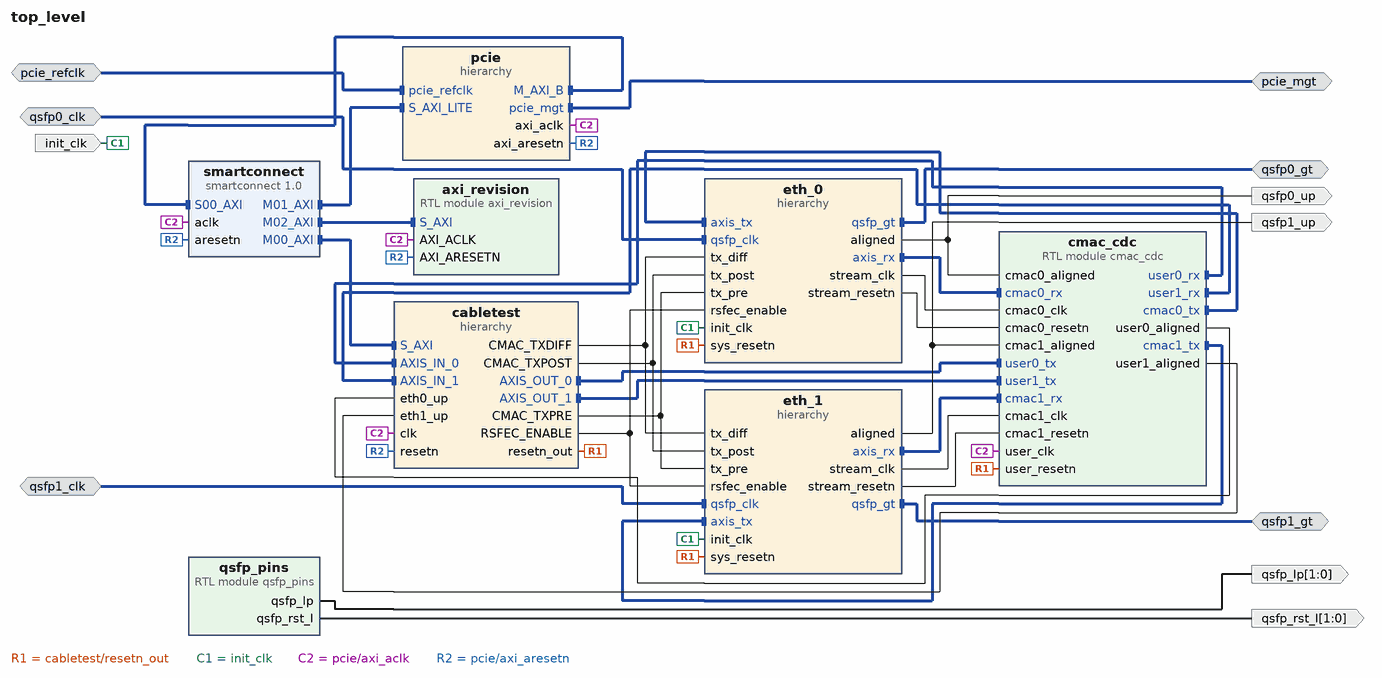
[diagram p0: block diagram of the top level]
# Vivado block design top_level, xcku15p-ffve1517-3-e, Vivado 2021.1
create_bd_design top_level

create_bd_intf_port -mode Slave -vlnv xilinx.com:interface:diff_clock_rtl:1.0 pcie_refclk
create_bd_intf_port -mode Master -vlnv xilinx.com:interface:pcie_7x_mgt_rtl:1.0 pcie_mgt
create_bd_intf_port -mode Slave -vlnv xilinx.com:interface:diff_clock_rtl:1.0 qsfp0_clk
set_property -dict {CONFIG.FREQ_HZ 322265625} [get_bd_intf_ports qsfp0_clk]
create_bd_intf_port -mode Master -vlnv xilinx.com:interface:gt_rtl:1.0 qsfp0_gt
create_bd_intf_port -mode Master -vlnv xilinx.com:interface:gt_rtl:1.0 qsfp1_gt
create_bd_intf_port -mode Slave -vlnv xilinx.com:interface:diff_clock_rtl:1.0 qsfp1_clk
set_property -dict {CONFIG.FREQ_HZ 322265625} [get_bd_intf_ports qsfp1_clk]
create_bd_port -dir O qsfp1_up
create_bd_port -dir O qsfp0_up
create_bd_port -dir I init_clk
create_bd_port -dir O -from 1 -to 0 qsfp_lp
create_bd_port -dir O -from 1 -to 0 qsfp_rst_l

create_bd_cell -type hier pcie
create_bd_cell -type hier eth_0
create_bd_cell -type ip -vlnv xilinx.com:ip:smartconnect:1.0 smartconnect
set_property -dict {CONFIG.NUM_CLKS 1 CONFIG.NUM_MI 3 CONFIG.NUM_SI 2} [get_bd_cells smartconnect]
create_bd_cell -type hier eth_1
create_bd_cell -type hier cabletest
create_bd_cell -type module -reference cmac_cdc cmac_cdc
create_bd_cell -type module -reference qsfp_pins qsfp_pins
create_bd_cell -type module -reference axi_revision axi_revision

# ---- hierarchy /pcie ----
current_bd_instance /pcie
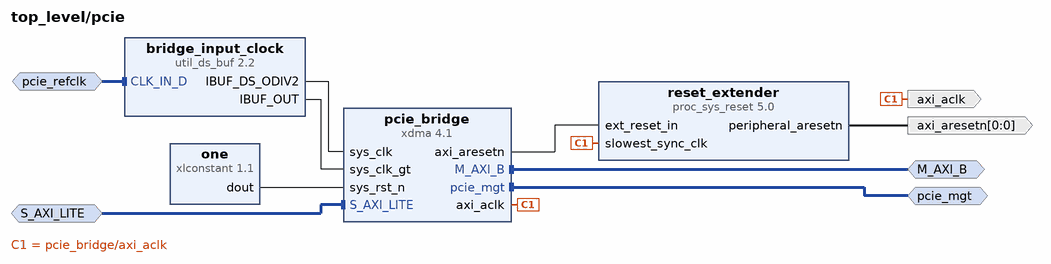
[diagram p1: block diagram inside /pcie]
create_bd_intf_pin -mode Master -vlnv xilinx.com:interface:aximm_rtl:1.0 M_AXI_B
create_bd_intf_pin -mode Slave -vlnv xilinx.com:interface:aximm_rtl:1.0 S_AXI_LITE
create_bd_intf_pin -mode Master -vlnv xilinx.com:interface:pcie_7x_mgt_rtl:1.0 pcie_mgt
create_bd_intf_pin -mode Slave -vlnv xilinx.com:interface:diff_clock_rtl:1.0 pcie_refclk
create_bd_pin -dir O -type clk axi_aclk
create_bd_pin -dir O -from 0 -to 0 -type rst axi_aresetn

create_bd_cell -type ip -vlnv xilinx.com:ip:util_ds_buf:2.2 bridge_input_clock
set_property -dict {CONFIG.C_BUF_TYPE IBUFDSGTE} [get_bd_cells bridge_input_clock]
create_bd_cell -type ip -vlnv xilinx.com:ip:xdma:4.1 pcie_bridge
set_property -dict [list \
  CONFIG.PF0_DEVICE_ID_mqdma 903F \
  CONFIG.PF0_SRIOV_VF_DEVICE_ID A03F \
  CONFIG.PF2_DEVICE_ID_mqdma 923F \
  CONFIG.PF3_DEVICE_ID_mqdma 933F \
  CONFIG.axi_addr_width 64 \
  CONFIG.axi_data_width 512_bit \
  CONFIG.axisten_freq 250 \
  CONFIG.bridge_burst true \
  CONFIG.dma_reset_source_sel User_Reset \
  CONFIG.en_axi_slave_if false \
  CONFIG.enable_jtag_dbg false \
  CONFIG.functional_mode AXI_Bridge \
  CONFIG.mode_selection Advanced \
  CONFIG.pcie_blk_locn X0Y3 \
  CONFIG.pf0_bar0_scale Megabytes \
  CONFIG.pf0_bar0_size 1 \
  CONFIG.pf0_bar1_enabled true \
  CONFIG.pf0_bar1_scale Megabytes \
  CONFIG.pf0_bar1_size 1 \
  CONFIG.pf0_device_id 903F \
  CONFIG.pl_link_cap_max_link_speed 8.0_GT/s \
  CONFIG.pl_link_cap_max_link_width X16 \
  CONFIG.plltype QPLL1 \
] [get_bd_cells pcie_bridge]
create_bd_cell -type ip -vlnv xilinx.com:ip:xlconstant:1.1 one
create_bd_cell -type ip -vlnv xilinx.com:ip:proc_sys_reset:5.0 reset_extender

# ---- hierarchy /eth_0 ----
current_bd_instance /eth_0
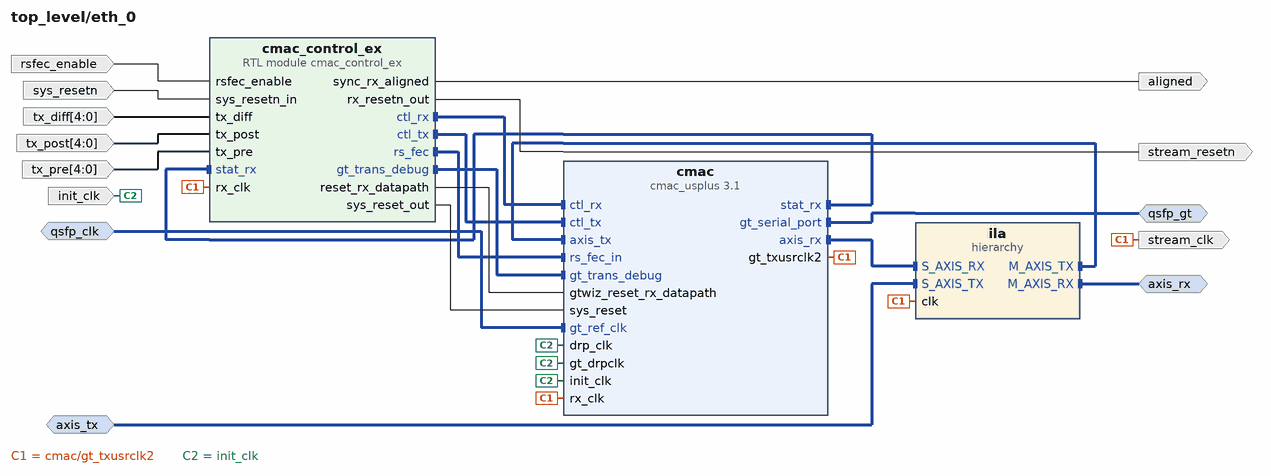
[diagram p2: block diagram inside /eth_0]
create_bd_intf_pin -mode Master -vlnv xilinx.com:interface:gt_rtl:1.0 qsfp_gt
create_bd_intf_pin -mode Slave -vlnv xilinx.com:interface:diff_clock_rtl:1.0 qsfp_clk
create_bd_intf_pin -mode Slave -vlnv xilinx.com:interface:axis_rtl:1.0 axis_tx
create_bd_intf_pin -mode Master -vlnv xilinx.com:interface:axis_rtl:1.0 axis_rx
create_bd_pin -dir I -type rst sys_resetn
create_bd_pin -dir O -type clk stream_clk
create_bd_pin -dir O -type rst stream_resetn
create_bd_pin -dir O aligned
create_bd_pin -dir I init_clk
create_bd_pin -dir I rsfec_enable
create_bd_pin -dir I -from 4 -to 0 tx_pre
create_bd_pin -dir I -from 4 -to 0 tx_post
create_bd_pin -dir I -from 4 -to 0 tx_diff

create_bd_cell -type ip -vlnv xilinx.com:ip:cmac_usplus:3.1 cmac
set_property -dict [list \
  CONFIG.ADD_GT_CNRL_STS_PORTS 1 \
  CONFIG.CMAC_CAUI4_MODE 1 \
  CONFIG.CMAC_CORE_SELECT CMACE4_X0Y0 \
  CONFIG.GT_DRP_CLK 200 \
  CONFIG.GT_GROUP_SELECT {X0Y0~X0Y3} \
  CONFIG.GT_REF_CLK_FREQ 322.265625 \
  CONFIG.INCLUDE_RS_FEC 1 \
  CONFIG.NUM_LANES 4x25 \
  CONFIG.RX_FLOW_CONTROL 0 \
  CONFIG.TX_FLOW_CONTROL 0 \
  CONFIG.USER_INTERFACE AXIS \
] [get_bd_cells cmac]
create_bd_cell -type module -reference cmac_control_ex cmac_control_ex
create_bd_cell -type hier ila

# ---- hierarchy /eth_0/ila ----
current_bd_instance /eth_0/ila
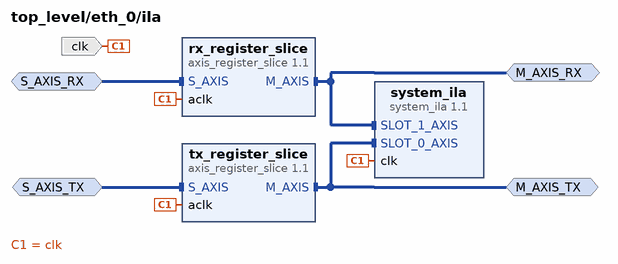
[diagram p3: block diagram inside /eth_0/ila]
create_bd_intf_pin -mode Slave -vlnv xilinx.com:interface:axis_rtl:1.0 S_AXIS_TX
create_bd_intf_pin -mode Master -vlnv xilinx.com:interface:axis_rtl:1.0 M_AXIS_TX
create_bd_intf_pin -mode Master -vlnv xilinx.com:interface:axis_rtl:1.0 M_AXIS_RX
create_bd_intf_pin -mode Slave -vlnv xilinx.com:interface:axis_rtl:1.0 S_AXIS_RX
create_bd_pin -dir I clk

create_bd_cell -type ip -vlnv xilinx.com:ip:axis_register_slice:1.1 tx_register_slice
create_bd_cell -type ip -vlnv xilinx.com:ip:axis_register_slice:1.1 rx_register_slice
create_bd_cell -type ip -vlnv xilinx.com:ip:system_ila:1.1 system_ila
set_property -dict [list \
  CONFIG.C_DATA_DEPTH 2048 \
  CONFIG.C_NUM_MONITOR_SLOTS 2 \
  CONFIG.C_SLOT 1 \
  CONFIG.C_SLOT_0_INTF_TYPE xilinx.com:interface:axis_rtl:1.0 \
  CONFIG.C_SLOT_1_INTF_TYPE xilinx.com:interface:axis_rtl:1.0 \
] [get_bd_cells system_ila]

# ---- hierarchy /eth_1 ----
current_bd_instance /eth_1
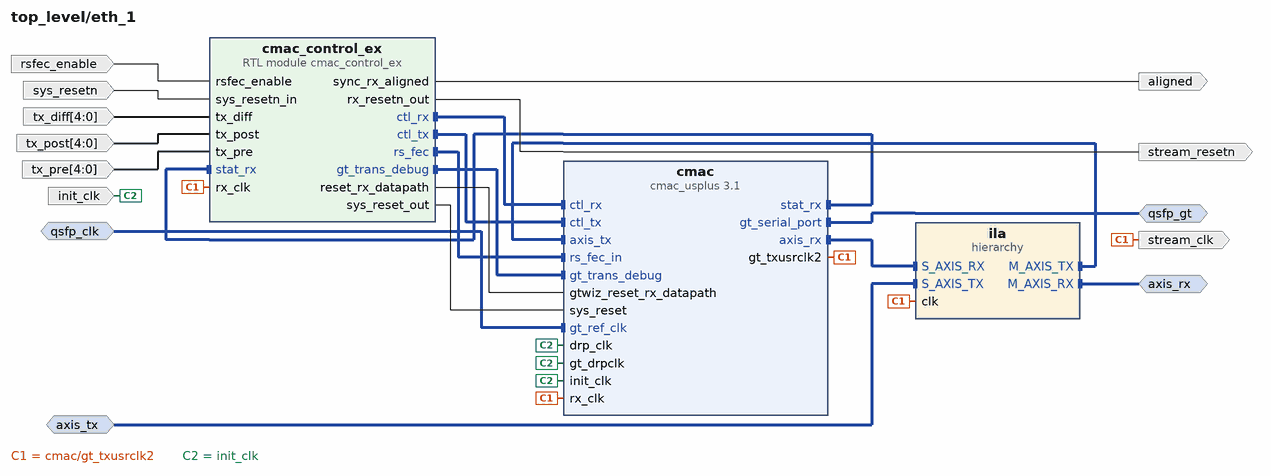
[diagram p4: block diagram inside /eth_1]
create_bd_intf_pin -mode Master -vlnv xilinx.com:interface:gt_rtl:1.0 qsfp_gt
create_bd_intf_pin -mode Slave -vlnv xilinx.com:interface:diff_clock_rtl:1.0 qsfp_clk
create_bd_intf_pin -mode Slave -vlnv xilinx.com:interface:axis_rtl:1.0 axis_tx
create_bd_intf_pin -mode Master -vlnv xilinx.com:interface:axis_rtl:1.0 axis_rx
create_bd_pin -dir I -type rst sys_resetn
create_bd_pin -dir O -type clk stream_clk
create_bd_pin -dir O -type rst stream_resetn
create_bd_pin -dir O aligned
create_bd_pin -dir I init_clk
create_bd_pin -dir I rsfec_enable
create_bd_pin -dir I -from 4 -to 0 tx_pre
create_bd_pin -dir I -from 4 -to 0 tx_post
create_bd_pin -dir I -from 4 -to 0 tx_diff

create_bd_cell -type ip -vlnv xilinx.com:ip:cmac_usplus:3.1 cmac
set_property -dict [list \
  CONFIG.ADD_GT_CNRL_STS_PORTS 1 \
  CONFIG.CMAC_CAUI4_MODE 1 \
  CONFIG.CMAC_CORE_SELECT CMACE4_X0Y1 \
  CONFIG.GT_DRP_CLK 200 \
  CONFIG.GT_GROUP_SELECT {X0Y4~X0Y7} \
  CONFIG.GT_REF_CLK_FREQ 322.265625 \
  CONFIG.INCLUDE_RS_FEC 1 \
  CONFIG.NUM_LANES 4x25 \
  CONFIG.RX_FLOW_CONTROL 0 \
  CONFIG.TX_FLOW_CONTROL 0 \
  CONFIG.USER_INTERFACE AXIS \
] [get_bd_cells cmac]
create_bd_cell -type module -reference cmac_control_ex cmac_control_ex
create_bd_cell -type hier ila

# ---- hierarchy /eth_1/ila ----
current_bd_instance /eth_1/ila
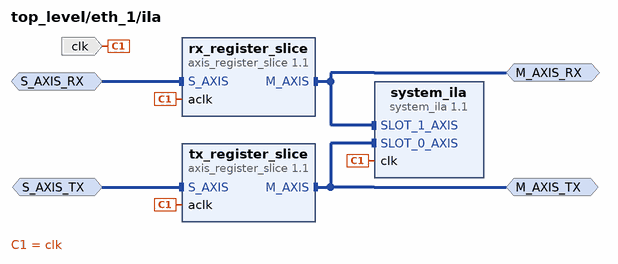
[diagram p5: block diagram inside /eth_1/ila]
create_bd_intf_pin -mode Slave -vlnv xilinx.com:interface:axis_rtl:1.0 S_AXIS_TX
create_bd_intf_pin -mode Master -vlnv xilinx.com:interface:axis_rtl:1.0 M_AXIS_TX
create_bd_intf_pin -mode Master -vlnv xilinx.com:interface:axis_rtl:1.0 M_AXIS_RX
create_bd_intf_pin -mode Slave -vlnv xilinx.com:interface:axis_rtl:1.0 S_AXIS_RX
create_bd_pin -dir I clk

create_bd_cell -type ip -vlnv xilinx.com:ip:axis_register_slice:1.1 tx_register_slice
create_bd_cell -type ip -vlnv xilinx.com:ip:axis_register_slice:1.1 rx_register_slice
create_bd_cell -type ip -vlnv xilinx.com:ip:system_ila:1.1 system_ila
set_property -dict [list \
  CONFIG.C_DATA_DEPTH 2048 \
  CONFIG.C_NUM_MONITOR_SLOTS 2 \
  CONFIG.C_SLOT 1 \
  CONFIG.C_SLOT_0_INTF_TYPE xilinx.com:interface:axis_rtl:1.0 \
  CONFIG.C_SLOT_1_INTF_TYPE xilinx.com:interface:axis_rtl:1.0 \
] [get_bd_cells system_ila]

# ---- hierarchy /cabletest ----
current_bd_instance /cabletest
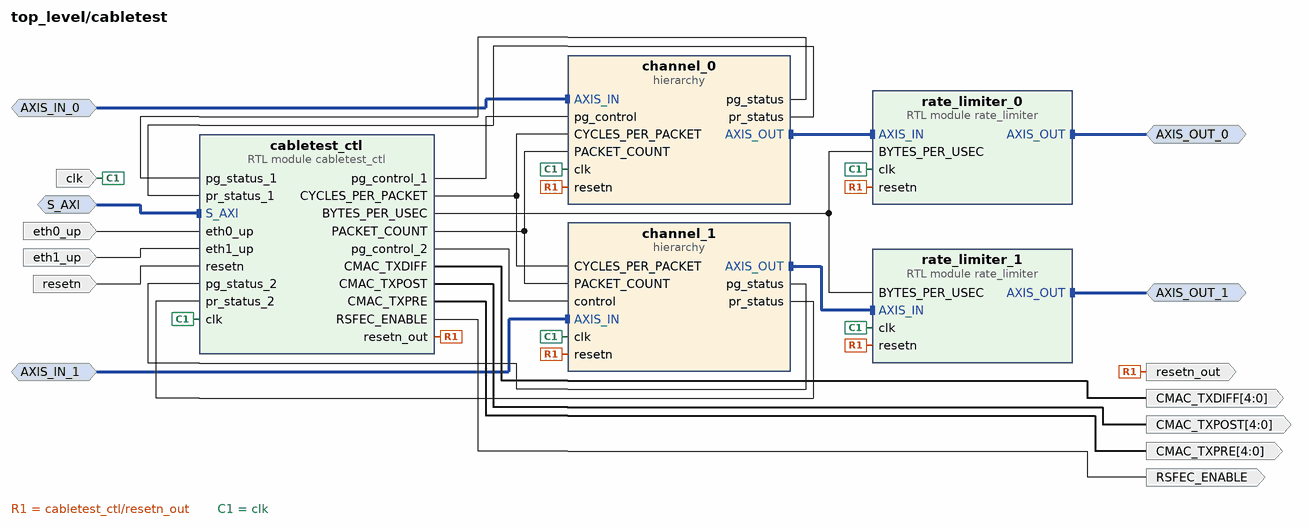
[diagram p6: block diagram inside /cabletest]
create_bd_intf_pin -mode Slave -vlnv xilinx.com:interface:aximm_rtl:1.0 S_AXI
create_bd_intf_pin -mode Master -vlnv xilinx.com:interface:axis_rtl:1.0 AXIS_OUT_0
create_bd_intf_pin -mode Slave -vlnv xilinx.com:interface:axis_rtl:1.0 AXIS_IN_0
create_bd_intf_pin -mode Master -vlnv xilinx.com:interface:axis_rtl:1.0 AXIS_OUT_1
create_bd_intf_pin -mode Slave -vlnv xilinx.com:interface:axis_rtl:1.0 AXIS_IN_1
create_bd_pin -dir I -type clk clk
create_bd_pin -dir I -type rst resetn
create_bd_pin -dir I eth0_up
create_bd_pin -dir I eth1_up
create_bd_pin -dir O -type rst resetn_out
create_bd_pin -dir O RSFEC_ENABLE
create_bd_pin -dir O -from 4 -to 0 CMAC_TXPRE
create_bd_pin -dir O -from 4 -to 0 CMAC_TXPOST
create_bd_pin -dir O -from 4 -to 0 CMAC_TXDIFF

create_bd_cell -type hier channel_0
create_bd_cell -type hier channel_1
create_bd_cell -type module -reference cabletest_ctl cabletest_ctl
set_property -dict {CONFIG.DEFAULT_TXPRE {"10100"}} [get_bd_cells cabletest_ctl]
create_bd_cell -type module -reference rate_limiter rate_limiter_0
create_bd_cell -type module -reference rate_limiter rate_limiter_1

# ---- hierarchy /cabletest/channel_0 ----
current_bd_instance /cabletest/channel_0
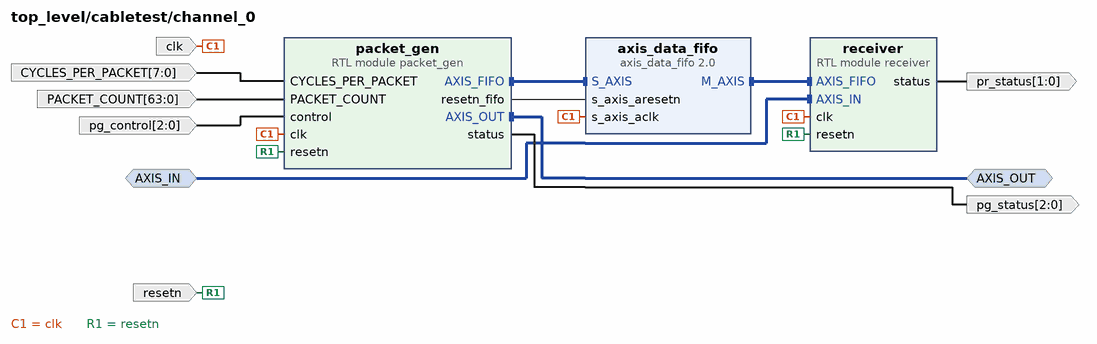
[diagram p7: block diagram inside /cabletest/channel_0]
create_bd_intf_pin -mode Master -vlnv xilinx.com:interface:axis_rtl:1.0 AXIS_OUT
create_bd_intf_pin -mode Slave -vlnv xilinx.com:interface:axis_rtl:1.0 AXIS_IN
create_bd_pin -dir I -type clk clk
create_bd_pin -dir I -type rst resetn
create_bd_pin -dir I -from 7 -to 0 CYCLES_PER_PACKET
create_bd_pin -dir I -from 2 -to 0 pg_control
create_bd_pin -dir I -from 63 -to 0 PACKET_COUNT
create_bd_pin -dir O -from 2 -to 0 pg_status
create_bd_pin -dir O -from 1 -to 0 pr_status

create_bd_cell -type ip -vlnv xilinx.com:ip:axis_data_fifo:2.0 axis_data_fifo
set_property -dict {CONFIG.FIFO_DEPTH 4096} [get_bd_cells axis_data_fifo]
create_bd_cell -type module -reference packet_gen packet_gen
create_bd_cell -type module -reference receiver receiver

# ---- hierarchy /cabletest/channel_1 ----
current_bd_instance /cabletest/channel_1
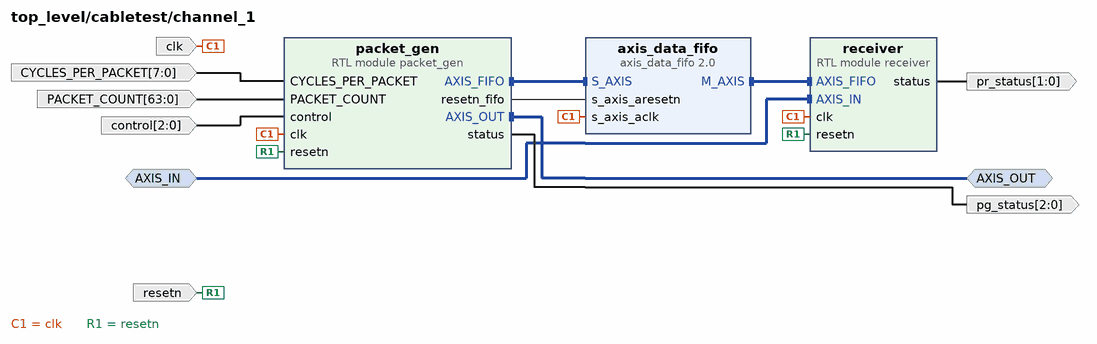
[diagram p8: block diagram inside /cabletest/channel_1]
create_bd_intf_pin -mode Master -vlnv xilinx.com:interface:axis_rtl:1.0 AXIS_OUT
create_bd_intf_pin -mode Slave -vlnv xilinx.com:interface:axis_rtl:1.0 AXIS_IN
create_bd_pin -dir I -type clk clk
create_bd_pin -dir I -type rst resetn
create_bd_pin -dir I -from 7 -to 0 CYCLES_PER_PACKET
create_bd_pin -dir I -from 2 -to 0 control
create_bd_pin -dir I -from 63 -to 0 PACKET_COUNT
create_bd_pin -dir O -from 2 -to 0 pg_status
create_bd_pin -dir O -from 1 -to 0 pr_status

create_bd_cell -type ip -vlnv xilinx.com:ip:axis_data_fifo:2.0 axis_data_fifo
set_property -dict {CONFIG.FIFO_DEPTH 4096} [get_bd_cells axis_data_fifo]
create_bd_cell -type module -reference packet_gen packet_gen
create_bd_cell -type module -reference receiver receiver

# ---- connections ----

current_bd_instance /pcie
connect_bd_intf_net [get_bd_intf_pins pcie_refclk] [get_bd_intf_pins bridge_input_clock/CLK_IN_D]
connect_bd_intf_net [get_bd_intf_pins S_AXI_LITE] [get_bd_intf_pins pcie_bridge/S_AXI_LITE]
connect_bd_intf_net [get_bd_intf_pins M_AXI_B] [get_bd_intf_pins pcie_bridge/M_AXI_B]
connect_bd_intf_net [get_bd_intf_pins pcie_mgt] [get_bd_intf_pins pcie_bridge/pcie_mgt]
connect_bd_net [get_bd_pins bridge_input_clock/IBUF_DS_ODIV2] [get_bd_pins pcie_bridge/sys_clk]
connect_bd_net [get_bd_pins bridge_input_clock/IBUF_OUT] [get_bd_pins pcie_bridge/sys_clk_gt]
connect_bd_net [get_bd_pins one/dout] [get_bd_pins pcie_bridge/sys_rst_n]
connect_bd_net [get_bd_pins pcie_bridge/axi_aresetn] [get_bd_pins reset_extender/ext_reset_in]
connect_bd_net -net proc_sys_reset_0_peripheral_aresetn [get_bd_pins reset_extender/peripheral_aresetn] [get_bd_pins axi_aresetn]
connect_bd_net -net xdma_0_axi_aclk [get_bd_pins pcie_bridge/axi_aclk] [get_bd_pins axi_aclk] [get_bd_pins reset_extender/slowest_sync_clk]

current_bd_instance /eth_0
connect_bd_intf_net [get_bd_intf_pins ila/S_AXIS_RX] [get_bd_intf_pins cmac/axis_rx]
connect_bd_intf_net [get_bd_intf_pins axis_tx] [get_bd_intf_pins ila/S_AXIS_TX]
connect_bd_intf_net [get_bd_intf_pins cmac/ctl_rx] [get_bd_intf_pins cmac_control_ex/ctl_rx]
connect_bd_intf_net [get_bd_intf_pins cmac/ctl_tx] [get_bd_intf_pins cmac_control_ex/ctl_tx]
connect_bd_intf_net [get_bd_intf_pins cmac/rs_fec_in] [get_bd_intf_pins cmac_control_ex/rs_fec]
connect_bd_intf_net [get_bd_intf_pins cmac_control_ex/gt_trans_debug] [get_bd_intf_pins cmac/gt_trans_debug]
connect_bd_intf_net [get_bd_intf_pins cmac/stat_rx] [get_bd_intf_pins cmac_control_ex/stat_rx]
connect_bd_intf_net [get_bd_intf_pins qsfp_gt] [get_bd_intf_pins cmac/gt_serial_port]
connect_bd_intf_net [get_bd_intf_pins qsfp_clk] [get_bd_intf_pins cmac/gt_ref_clk]
connect_bd_intf_net [get_bd_intf_pins axis_rx] [get_bd_intf_pins ila/M_AXIS_RX]
connect_bd_intf_net [get_bd_intf_pins ila/M_AXIS_TX] [get_bd_intf_pins cmac/axis_tx]
connect_bd_net -net cmac_control_ex_0_reset_rx_datapath [get_bd_pins cmac_control_ex/reset_rx_datapath] [get_bd_pins cmac/gtwiz_reset_rx_datapath]
connect_bd_net -net cmac_control_ex_0_rx_resetn_out [get_bd_pins cmac_control_ex/rx_resetn_out] [get_bd_pins stream_resetn]
connect_bd_net -net cmac_control_ex_0_sync_rx_aligned [get_bd_pins cmac_control_ex/sync_rx_aligned] [get_bd_pins aligned]
connect_bd_net -net cmac_control_ex_0_sys_reset_out [get_bd_pins cmac_control_ex/sys_reset_out] [get_bd_pins cmac/sys_reset]
connect_bd_net -net cmac_gt_rxusrclk2 [get_bd_pins cmac/gt_txusrclk2] \
  [get_bd_pins cmac/rx_clk] [get_bd_pins stream_clk] [get_bd_pins cmac_control_ex/rx_clk] [get_bd_pins ila/clk]
connect_bd_net [get_bd_pins init_clk] [get_bd_pins cmac/drp_clk] [get_bd_pins cmac/init_clk] [get_bd_pins cmac/gt_drpclk]
connect_bd_net [get_bd_pins rsfec_enable] [get_bd_pins cmac_control_ex/rsfec_enable]
connect_bd_net [get_bd_pins sys_resetn] [get_bd_pins cmac_control_ex/sys_resetn_in]
connect_bd_net [get_bd_pins tx_diff] [get_bd_pins cmac_control_ex/tx_diff]
connect_bd_net [get_bd_pins tx_post] [get_bd_pins cmac_control_ex/tx_post]
connect_bd_net [get_bd_pins tx_pre] [get_bd_pins cmac_control_ex/tx_pre]

current_bd_instance /eth_0/ila
connect_bd_intf_net [get_bd_intf_pins S_AXIS_RX] [get_bd_intf_pins rx_register_slice/S_AXIS]
connect_bd_intf_net [get_bd_intf_pins S_AXIS_TX] [get_bd_intf_pins tx_register_slice/S_AXIS]
connect_bd_intf_net [get_bd_intf_pins M_AXIS_RX] [get_bd_intf_pins rx_register_slice/M_AXIS]
connect_bd_intf_net [get_bd_intf_pins M_AXIS_RX] [get_bd_intf_pins system_ila/SLOT_1_AXIS]
connect_bd_intf_net [get_bd_intf_pins M_AXIS_TX] [get_bd_intf_pins tx_register_slice/M_AXIS]
connect_bd_intf_net [get_bd_intf_pins M_AXIS_TX] [get_bd_intf_pins system_ila/SLOT_0_AXIS]
connect_bd_net [get_bd_pins clk] [get_bd_pins tx_register_slice/aclk] [get_bd_pins rx_register_slice/aclk] [get_bd_pins system_ila/clk]

current_bd_instance /eth_1
connect_bd_intf_net [get_bd_intf_pins ila/S_AXIS_RX] [get_bd_intf_pins cmac/axis_rx]
connect_bd_intf_net [get_bd_intf_pins axis_tx] [get_bd_intf_pins ila/S_AXIS_TX]
connect_bd_intf_net [get_bd_intf_pins cmac/ctl_rx] [get_bd_intf_pins cmac_control_ex/ctl_rx]
connect_bd_intf_net [get_bd_intf_pins cmac/ctl_tx] [get_bd_intf_pins cmac_control_ex/ctl_tx]
connect_bd_intf_net [get_bd_intf_pins cmac/rs_fec_in] [get_bd_intf_pins cmac_control_ex/rs_fec]
connect_bd_intf_net [get_bd_intf_pins cmac_control_ex/gt_trans_debug] [get_bd_intf_pins cmac/gt_trans_debug]
connect_bd_intf_net [get_bd_intf_pins cmac/stat_rx] [get_bd_intf_pins cmac_control_ex/stat_rx]
connect_bd_intf_net [get_bd_intf_pins qsfp_gt] [get_bd_intf_pins cmac/gt_serial_port]
connect_bd_intf_net [get_bd_intf_pins qsfp_clk] [get_bd_intf_pins cmac/gt_ref_clk]
connect_bd_intf_net [get_bd_intf_pins axis_rx] [get_bd_intf_pins ila/M_AXIS_RX]
connect_bd_intf_net [get_bd_intf_pins cmac/axis_tx] [get_bd_intf_pins ila/M_AXIS_TX]
connect_bd_net [get_bd_pins cmac_control_ex/reset_rx_datapath] [get_bd_pins cmac/gtwiz_reset_rx_datapath]
connect_bd_net [get_bd_pins cmac_control_ex/rx_resetn_out] [get_bd_pins stream_resetn]
connect_bd_net [get_bd_pins cmac_control_ex/sync_rx_aligned] [get_bd_pins aligned]
connect_bd_net [get_bd_pins cmac_control_ex/sys_reset_out] [get_bd_pins cmac/sys_reset]
connect_bd_net -net cmac_gt_rxusrclk2 [get_bd_pins cmac/gt_txusrclk2] \
  [get_bd_pins cmac/rx_clk] [get_bd_pins stream_clk] [get_bd_pins cmac_control_ex/rx_clk] [get_bd_pins ila/clk]
connect_bd_net [get_bd_pins init_clk] [get_bd_pins cmac/init_clk] [get_bd_pins cmac/drp_clk] [get_bd_pins cmac/gt_drpclk]
connect_bd_net [get_bd_pins rsfec_enable] [get_bd_pins cmac_control_ex/rsfec_enable]
connect_bd_net [get_bd_pins sys_resetn] [get_bd_pins cmac_control_ex/sys_resetn_in]
connect_bd_net [get_bd_pins tx_diff] [get_bd_pins cmac_control_ex/tx_diff]
connect_bd_net [get_bd_pins tx_post] [get_bd_pins cmac_control_ex/tx_post]
connect_bd_net [get_bd_pins tx_pre] [get_bd_pins cmac_control_ex/tx_pre]

current_bd_instance /eth_1/ila
connect_bd_intf_net [get_bd_intf_pins S_AXIS_RX] [get_bd_intf_pins rx_register_slice/S_AXIS]
connect_bd_intf_net [get_bd_intf_pins S_AXIS_TX] [get_bd_intf_pins tx_register_slice/S_AXIS]
connect_bd_intf_net [get_bd_intf_pins M_AXIS_RX] [get_bd_intf_pins rx_register_slice/M_AXIS]
connect_bd_intf_net [get_bd_intf_pins M_AXIS_RX] [get_bd_intf_pins system_ila/SLOT_1_AXIS]
connect_bd_intf_net [get_bd_intf_pins M_AXIS_TX] [get_bd_intf_pins tx_register_slice/M_AXIS]
connect_bd_intf_net [get_bd_intf_pins M_AXIS_TX] [get_bd_intf_pins system_ila/SLOT_0_AXIS]
connect_bd_net [get_bd_pins clk] [get_bd_pins tx_register_slice/aclk] [get_bd_pins rx_register_slice/aclk] [get_bd_pins system_ila/clk]

current_bd_instance /cabletest
connect_bd_intf_net [get_bd_intf_pins AXIS_IN_0] [get_bd_intf_pins channel_0/AXIS_IN]
connect_bd_intf_net [get_bd_intf_pins AXIS_IN_1] [get_bd_intf_pins channel_1/AXIS_IN]
connect_bd_intf_net [get_bd_intf_pins rate_limiter_0/AXIS_IN] [get_bd_intf_pins channel_0/AXIS_OUT]
connect_bd_intf_net [get_bd_intf_pins channel_1/AXIS_OUT] [get_bd_intf_pins rate_limiter_1/AXIS_IN]
connect_bd_intf_net [get_bd_intf_pins AXIS_OUT_0] [get_bd_intf_pins rate_limiter_0/AXIS_OUT]
connect_bd_intf_net [get_bd_intf_pins AXIS_OUT_1] [get_bd_intf_pins rate_limiter_1/AXIS_OUT]
connect_bd_intf_net [get_bd_intf_pins S_AXI] [get_bd_intf_pins cabletest_ctl/S_AXI]
connect_bd_net [get_bd_pins cabletest_ctl/BYTES_PER_USEC] [get_bd_pins rate_limiter_0/BYTES_PER_USEC] [get_bd_pins rate_limiter_1/BYTES_PER_USEC]
connect_bd_net [get_bd_pins cabletest_ctl/CMAC_TXDIFF] [get_bd_pins CMAC_TXDIFF]
connect_bd_net [get_bd_pins cabletest_ctl/CMAC_TXPOST] [get_bd_pins CMAC_TXPOST]
connect_bd_net [get_bd_pins cabletest_ctl/CMAC_TXPRE] [get_bd_pins CMAC_TXPRE]
connect_bd_net [get_bd_pins cabletest_ctl/CYCLES_PER_PACKET] [get_bd_pins channel_0/CYCLES_PER_PACKET] [get_bd_pins channel_1/CYCLES_PER_PACKET]
connect_bd_net [get_bd_pins cabletest_ctl/PACKET_COUNT] [get_bd_pins channel_0/PACKET_COUNT] [get_bd_pins channel_1/PACKET_COUNT]
connect_bd_net [get_bd_pins cabletest_ctl/RSFEC_ENABLE] [get_bd_pins RSFEC_ENABLE]
connect_bd_net [get_bd_pins cabletest_ctl/pg_control_1] [get_bd_pins channel_0/pg_control]
connect_bd_net [get_bd_pins cabletest_ctl/resetn_out] \
  [get_bd_pins channel_0/resetn] [get_bd_pins channel_1/resetn] [get_bd_pins resetn_out] [get_bd_pins rate_limiter_0/resetn] \
  [get_bd_pins rate_limiter_1/resetn]
connect_bd_net -net channel_0_status [get_bd_pins channel_0/pg_status] [get_bd_pins cabletest_ctl/pg_status_1]
connect_bd_net -net channel_0_status1 [get_bd_pins channel_0/pr_status] [get_bd_pins cabletest_ctl/pr_status_1]
connect_bd_net [get_bd_pins channel_1/pg_status] [get_bd_pins cabletest_ctl/pg_status_2]
connect_bd_net [get_bd_pins channel_1/pr_status] [get_bd_pins cabletest_ctl/pr_status_2]
connect_bd_net -net cmac_cdc_user0_aligned [get_bd_pins eth0_up] [get_bd_pins cabletest_ctl/eth0_up]
connect_bd_net -net cmac_cdc_user1_aligned [get_bd_pins eth1_up] [get_bd_pins cabletest_ctl/eth1_up]
connect_bd_net -net control_1 [get_bd_pins cabletest_ctl/pg_control_2] [get_bd_pins channel_1/control]
connect_bd_net -net source_200Mhz_clk [get_bd_pins clk] \
  [get_bd_pins channel_0/clk] [get_bd_pins channel_1/clk] [get_bd_pins cabletest_ctl/clk] [get_bd_pins rate_limiter_0/clk] \
  [get_bd_pins rate_limiter_1/clk]
connect_bd_net -net source_200Mhz_resetn [get_bd_pins resetn] [get_bd_pins cabletest_ctl/resetn]

current_bd_instance /cabletest/channel_0
connect_bd_intf_net [get_bd_intf_pins AXIS_OUT] [get_bd_intf_pins packet_gen/AXIS_OUT]
connect_bd_intf_net [get_bd_intf_pins AXIS_IN] [get_bd_intf_pins receiver/AXIS_IN]
connect_bd_intf_net [get_bd_intf_pins receiver/AXIS_FIFO] [get_bd_intf_pins axis_data_fifo/M_AXIS]
connect_bd_intf_net [get_bd_intf_pins packet_gen/AXIS_FIFO] [get_bd_intf_pins axis_data_fifo/S_AXIS]
connect_bd_net [get_bd_pins CYCLES_PER_PACKET] [get_bd_pins packet_gen/CYCLES_PER_PACKET]
connect_bd_net [get_bd_pins PACKET_COUNT] [get_bd_pins packet_gen/PACKET_COUNT]
connect_bd_net [get_bd_pins clk] [get_bd_pins axis_data_fifo/s_axis_aclk] [get_bd_pins packet_gen/clk] [get_bd_pins receiver/clk]
connect_bd_net -net control_1 [get_bd_pins pg_control] [get_bd_pins packet_gen/control]
connect_bd_net [get_bd_pins packet_gen/resetn_fifo] [get_bd_pins axis_data_fifo/s_axis_aresetn]
connect_bd_net [get_bd_pins packet_gen/status] [get_bd_pins pg_status]
connect_bd_net [get_bd_pins receiver/status] [get_bd_pins pr_status]
connect_bd_net [get_bd_pins resetn] [get_bd_pins packet_gen/resetn] [get_bd_pins receiver/resetn]

current_bd_instance /cabletest/channel_1
connect_bd_intf_net [get_bd_intf_pins AXIS_OUT] [get_bd_intf_pins packet_gen/AXIS_OUT]
connect_bd_intf_net [get_bd_intf_pins AXIS_IN] [get_bd_intf_pins receiver/AXIS_IN]
connect_bd_intf_net [get_bd_intf_pins receiver/AXIS_FIFO] [get_bd_intf_pins axis_data_fifo/M_AXIS]
connect_bd_intf_net [get_bd_intf_pins packet_gen/AXIS_FIFO] [get_bd_intf_pins axis_data_fifo/S_AXIS]
connect_bd_net [get_bd_pins CYCLES_PER_PACKET] [get_bd_pins packet_gen/CYCLES_PER_PACKET]
connect_bd_net [get_bd_pins PACKET_COUNT] [get_bd_pins packet_gen/PACKET_COUNT]
connect_bd_net [get_bd_pins clk] [get_bd_pins axis_data_fifo/s_axis_aclk] [get_bd_pins packet_gen/clk] [get_bd_pins receiver/clk]
connect_bd_net [get_bd_pins control] [get_bd_pins packet_gen/control]
connect_bd_net [get_bd_pins packet_gen/resetn_fifo] [get_bd_pins axis_data_fifo/s_axis_aresetn]
connect_bd_net [get_bd_pins packet_gen/status] [get_bd_pins pg_status]
connect_bd_net [get_bd_pins receiver/status] [get_bd_pins pr_status]
connect_bd_net [get_bd_pins resetn] [get_bd_pins packet_gen/resetn] [get_bd_pins receiver/resetn]

current_bd_instance /
connect_bd_intf_net [get_bd_intf_pins cabletest/AXIS_IN_0] [get_bd_intf_pins cmac_cdc/user0_rx]
connect_bd_intf_net [get_bd_intf_pins cabletest/AXIS_IN_1] [get_bd_intf_pins cmac_cdc/user1_rx]
connect_bd_intf_net [get_bd_intf_pins cmac_cdc/user0_tx] [get_bd_intf_pins cabletest/AXIS_OUT_0]
connect_bd_intf_net [get_bd_intf_pins cabletest/AXIS_OUT_1] [get_bd_intf_pins cmac_cdc/user1_tx]
connect_bd_intf_net [get_bd_intf_pins cmac_cdc/cmac0_tx] [get_bd_intf_pins eth_0/axis_tx]
connect_bd_intf_net [get_bd_intf_pins cmac_cdc/cmac1_tx] [get_bd_intf_pins eth_1/axis_tx]
connect_bd_intf_net [get_bd_intf_ports qsfp0_gt] [get_bd_intf_pins eth_0/qsfp_gt]
connect_bd_intf_net [get_bd_intf_pins cmac_cdc/cmac0_rx] [get_bd_intf_pins eth_0/axis_rx]
connect_bd_intf_net [get_bd_intf_pins cmac_cdc/cmac1_rx] [get_bd_intf_pins eth_1/axis_rx]
connect_bd_intf_net [get_bd_intf_ports qsfp1_gt] [get_bd_intf_pins eth_1/qsfp_gt]
connect_bd_intf_net [get_bd_intf_ports qsfp0_clk] [get_bd_intf_pins eth_0/qsfp_clk]
connect_bd_intf_net [get_bd_intf_ports pcie_refclk] [get_bd_intf_pins pcie/pcie_refclk]
connect_bd_intf_net [get_bd_intf_ports qsfp1_clk] [get_bd_intf_pins eth_1/qsfp_clk]
connect_bd_intf_net [get_bd_intf_pins pcie/S_AXI_LITE] [get_bd_intf_pins smartconnect/M01_AXI]
connect_bd_intf_net [get_bd_intf_pins cabletest/S_AXI] [get_bd_intf_pins smartconnect/M00_AXI]
connect_bd_intf_net [get_bd_intf_pins smartconnect/M02_AXI] [get_bd_intf_pins axi_revision/S_AXI]
connect_bd_intf_net [get_bd_intf_pins pcie/M_AXI_B] [get_bd_intf_pins smartconnect/S00_AXI]
connect_bd_intf_net [get_bd_intf_ports pcie_mgt] [get_bd_intf_pins pcie/pcie_mgt]
connect_bd_net [get_bd_pins cabletest/CMAC_TXDIFF] [get_bd_pins eth_0/tx_diff] [get_bd_pins eth_1/tx_diff]
connect_bd_net [get_bd_pins cabletest/CMAC_TXPOST] [get_bd_pins eth_0/tx_post] [get_bd_pins eth_1/tx_post]
connect_bd_net [get_bd_pins cabletest/CMAC_TXPRE] [get_bd_pins eth_0/tx_pre] [get_bd_pins eth_1/tx_pre]
connect_bd_net [get_bd_pins cabletest/RSFEC_ENABLE] [get_bd_pins eth_1/rsfec_enable] [get_bd_pins eth_0/rsfec_enable]
connect_bd_net [get_bd_pins cabletest/resetn_out] [get_bd_pins eth_0/sys_resetn] [get_bd_pins eth_1/sys_resetn] [get_bd_pins cmac_cdc/user_resetn]
connect_bd_net [get_bd_pins cmac_cdc/user0_aligned] [get_bd_pins cabletest/eth0_up]
connect_bd_net [get_bd_pins cmac_cdc/user1_aligned] [get_bd_pins cabletest/eth1_up]
connect_bd_net -net eth_0_stat_rx_aligned_0 [get_bd_pins eth_0/aligned] [get_bd_ports qsfp0_up] [get_bd_pins cmac_cdc/cmac0_aligned]
connect_bd_net [get_bd_pins eth_0/stream_clk] [get_bd_pins cmac_cdc/cmac0_clk]
connect_bd_net [get_bd_pins eth_0/stream_resetn] [get_bd_pins cmac_cdc/cmac0_resetn]
connect_bd_net -net eth_1_stat_rx_aligned_0 [get_bd_pins eth_1/aligned] [get_bd_ports qsfp1_up] [get_bd_pins cmac_cdc/cmac1_aligned]
connect_bd_net [get_bd_pins eth_1/stream_clk] [get_bd_pins cmac_cdc/cmac1_clk]
connect_bd_net [get_bd_pins eth_1/stream_resetn] [get_bd_pins cmac_cdc/cmac1_resetn]
connect_bd_net [get_bd_ports init_clk] [get_bd_pins eth_0/init_clk] [get_bd_pins eth_1/init_clk]
connect_bd_net [get_bd_pins qsfp_pins/qsfp_lp] [get_bd_ports qsfp_lp]
connect_bd_net [get_bd_pins qsfp_pins/qsfp_rst_l] [get_bd_ports qsfp_rst_l]
connect_bd_net -net source_200Mhz_clk [get_bd_pins pcie/axi_aclk] \
  [get_bd_pins smartconnect/aclk] [get_bd_pins cabletest/clk] [get_bd_pins cmac_cdc/user_clk] \
  [get_bd_pins axi_revision/AXI_ACLK]
connect_bd_net -net source_200Mhz_resetn [get_bd_pins pcie/axi_aresetn] \
  [get_bd_pins smartconnect/aresetn] [get_bd_pins cabletest/resetn] [get_bd_pins axi_revision/AXI_ARESETN]

# ---- address map ----
assign_bd_address -offset 0x0000000000000000 -range 128 -target_address_space [get_bd_addr_spaces pcie/pcie_bridge/M_AXI_B] [get_bd_addr_segs axi_revision/S_AXI/reg0]
assign_bd_address -offset 0x0000000000001000 -range 128 -target_address_space [get_bd_addr_spaces pcie/pcie_bridge/M_AXI_B] [get_bd_addr_segs cabletest/cabletest_ctl/S_AXI/reg0]
assign_bd_address -offset 0x0000000000010000 -range 64K -target_address_space [get_bd_addr_spaces pcie/pcie_bridge/M_AXI_B] [get_bd_addr_segs pcie/pcie_bridge/S_AXI_LITE/CTL0]

validate_bd_design
save_bd_design
